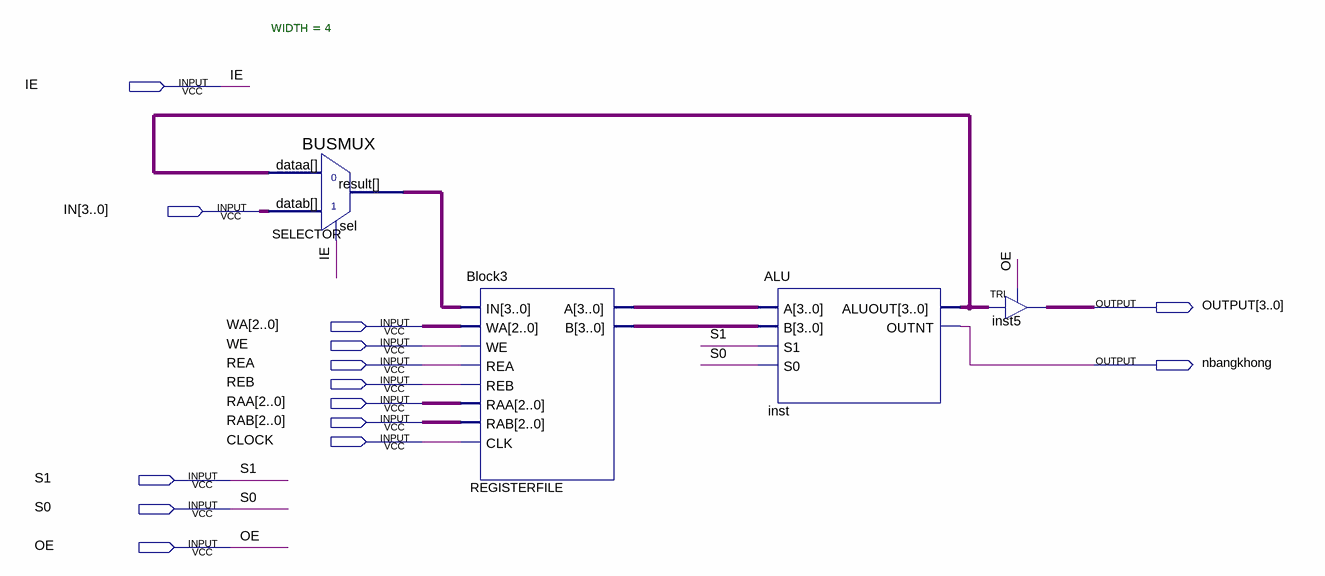
[diagram p0: schematic sheet]
// Quartus schematic Block1.bdf as structural Verilog: 4 symbols, 14 pins
module Block1 (
  input  IE,
  input  [3:0] IN,
  input  [2:0] WA,
  input  WE,
  input  REA,
  input  REB,
  input  [2:0] RAA,
  input  [2:0] RAB,
  input  CLOCK,
  input  S1,
  input  S0,
  input  OE,
  output [3:0] OUTPUT,
  output nbangkhong
);

  wire [3:0] inst_aluout, REGISTERFILE_a, REGISTERFILE_b, SELECTOR_result;

  BUSMUX #(.WIDTH(4)) SELECTOR (.datab(IN), .sel(IE), .dataa(inst_aluout), .result(SELECTOR_result));
  Block3 REGISTERFILE (
    .IN(SELECTOR_result), .WA(WA), .WE(WE), .REA(REA), .REB(REB), .RAA(RAA), .RAB(RAB), .CLK(CLOCK),
    .A(REGISTERFILE_a), .B(REGISTERFILE_b));
  ALU inst (.A(REGISTERFILE_a), .B(REGISTERFILE_b), .S1(S1), .S0(S0), .ALUOUT(inst_aluout), .OUTNT(nbangkhong));
  TRI inst5[3:0] (.IN(inst_aluout), .OE(OE), .OUT(OUTPUT));
endmodule
